# EAGLE schematic tx-rx (EAGLE 8.2.1)
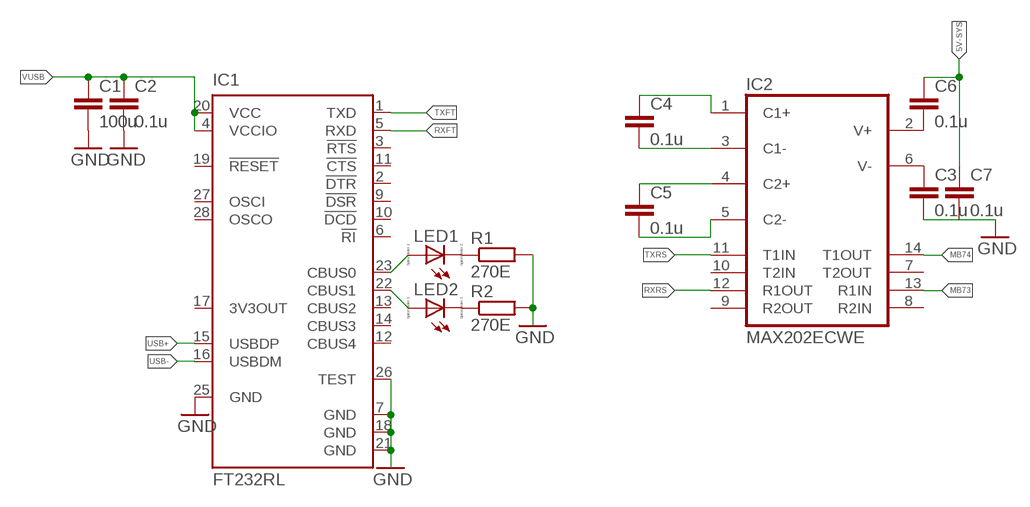
[diagram p0: schematic, sheet 1]

## Parts
C1  100u  C-EUC1206  [C1206]
C2  0.1u  C-EUC1206  [C1206]
C3  0.1u  C-EUC1206  [C1206]
C4  0.1u  C-EUC1206  [C1206]
C5  0.1u  C-EUC1206  [C1206]
C6  0.1u  C-EUC1206  [C1206]
C7  0.1u  C-EUC1206  [C1206]
IC1  FT232RL  [SSOP28]
IC2  MAX202ECWE  [SO16L]
LED1  LED_E  [LED_1206]
LED2  LED_E  [LED_1206]
R1  270E  R-EU_R1206  [R1206]
R2  270E  R-EU_R1206  [R1206]

## Nets
5V-SYS: C6.1 C7.1
GND: C1.2 C2.2 C3.2 IC1.7(GND) IC1.18(GND) IC1.21(GND) IC1.25(GND) IC1.26(TEST) R1.2
MB73: IC2.13(R1IN)
MB74: IC2.14(T1OUT)
N$1: C6.2 IC2.2(V+)
N$2: C3.1 IC2.6(V-)
N$3: IC1.23(CBUS0) LED1.A
N$4: IC1.22(CBUS1) LED2.A
N$5: LED1.C R1.1
N$6: LED2.C R2.1
N$7: C4.1 IC2.1(C1+)
N$8: C4.2 IC2.3(C1-)
N$9: C5.1 IC2.4(C2+)
N$10: C5.2 IC2.5(C2-)
RXFT: IC1.5(RXD)
RXRS: IC2.12(R1OUT)
TXFT: IC1.1(TXD)
TXRS: IC2.11(T1IN)
USB+: IC1.15(USBDP)
USB-: IC1.16(USBDM)
VUSB: C1.1 C2.1 IC1.4(VCCIO) IC1.20(VCC)
Unconnected: C7.2 IC1.2(!DTR) IC1.3(!RTS) IC1.6(!RI) IC1.9(!DSR) IC1.10(!DCD) IC1.11(!CTS) IC1.12(CBUS4) IC1.13(CBUS2) IC1.14(CBUS3) IC1.17(3V3OUT) IC1.19(!RESET) IC1.27(OSCI) IC1.28(OSCO) IC2.7(T2OUT) IC2.8(R2IN) IC2.9(R2OUT) IC2.10(T2IN) R2.2

## Power pins joined to a net without a drawn wire
GND: IC2.15(GND)
VCC: IC2.16(VCC)

## Library data of the parts
C1-C7 = rcl:C-EU: CAPACITOR, European symbol
IC1 = ftdichip:FT232R: Source: http://www.ftdichip.com/Documents/DataSheets/DS_FT232R_v104.pdf; MPN: FT232RL; OC_FARNELL: 1146032; OC_NEWARK: 91K9918
IC2 = maxim:MAX202ECWE: RS232 TRANSCEIVER; MPN: MAX202ECWE+T; OC_FARNELL: 9724419; OC_NEWARK: 67K4364
LED1 LED2 = eagle-ltspice:LED_E: LED Source: http://www.osram.convergy.de Source: www.luxeon.com Source: www.kingbright.com; SPICEMODEL: NONE; SPICEPREFIX: D; SPICETYPE: diode
R1 R2 = resistor:R-EU_: RESISTOR, European symbol